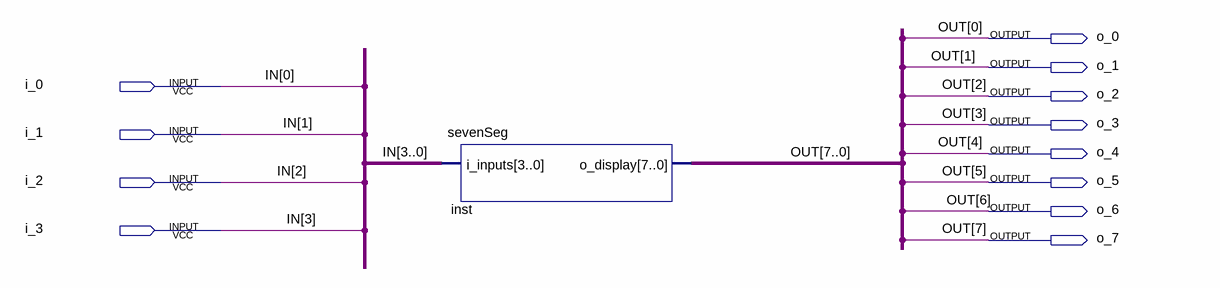
[diagram p0: schematic sheet]
// Quartus schematic sevenSeg_schematic.bdf as structural Verilog: 1 symbols, 12 pins
module sevenSeg_schematic (
  input  i_0,
  input  i_1,
  input  i_2,
  input  i_3,
  output o_0,
  output o_1,
  output o_2,
  output o_3,
  output o_4,
  output o_5,
  output o_6,
  output o_7
);

  sevenSeg inst (.i_inputs({i_3, i_2, i_1, i_0}), .o_display({o_7, o_6, o_5, o_4, o_3, o_2, o_1, o_0}));

  // Other names for the same wires on the sheet: IN[3:0] = {i_3, i_2, i_1, i_0};
  //   OUT[7:0] = {o_7, o_6, o_5, o_4, o_3, o_2, o_1, o_0}
endmodule
